# Altium project 测量放大器.PrjPCB
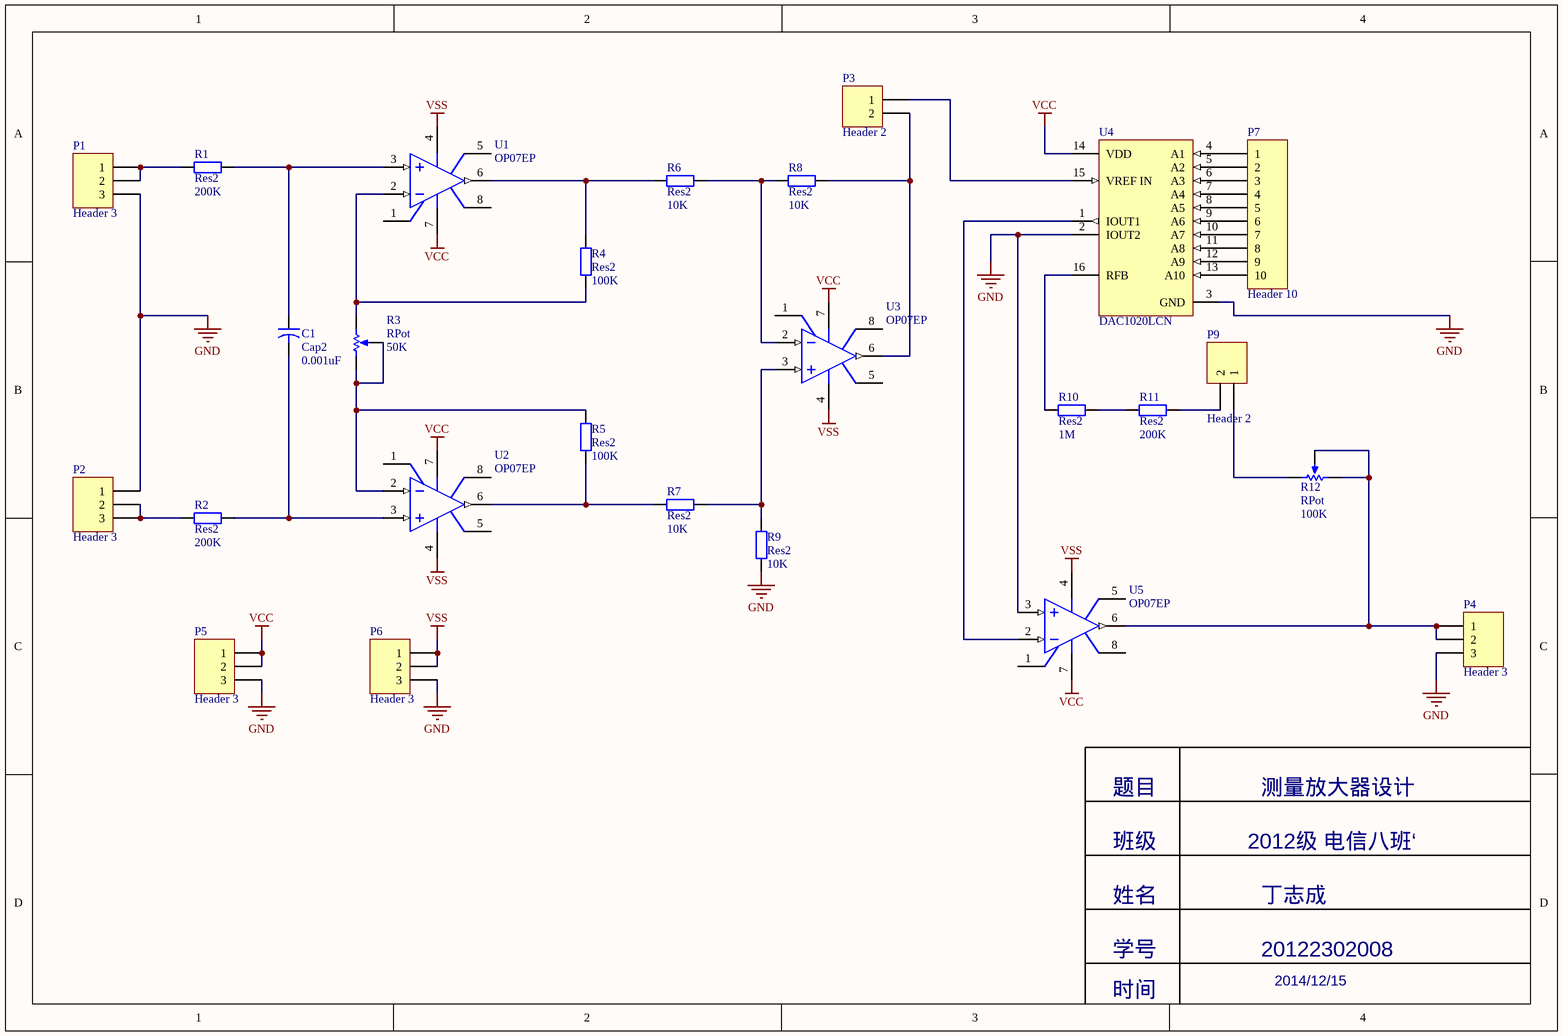
[diagram p0: 设计1.SchDoc]
1 sheet, 26 parts. Net scope: global (net labels, ports and power ports of the same name join across sheets).
Board files: 设计1-1.PCBDOC, 三人小组.PCBDOC, 三人小组v2.PCBDOC

## Sheet 设计1.SchDoc
size A4

### Parts
C1  Cap2  value 0.001uF  [CAPR5-4X5]
P1  Header 3  [HDR1X3]
P2  Header 3  [HDR1X3]
P3  Header 2  [HDR1X2]
P4  Header 3  [HDR1X3]
P5  Header 3  [HDR1X3]
P6  Header 3  [HDR1X3]
P7  Header 10  [HDR1X10]
P9  Header 2  [HDR1X2]
R1  Res2  value 200K  [AXIAL-0.4]
R2  Res2  value 200K  [AXIAL-0.4]
R3  RPot  value 50K  [VR5]
R4  Res2  value 100K  [AXIAL-0.4]
R5  Res2  value 100K  [AXIAL-0.4]
R6  Res2  value 10K  [AXIAL-0.4]
R7  Res2  value 10K  [AXIAL-0.4]
R8  Res2  value 10K  [AXIAL-0.4]
R9  Res2  value 10K  [AXIAL-0.4]
R10  Res2  value 1M  [AXIAL-0.4]
R11  Res2  value 200K  [AXIAL-0.4]
R12  RPot  value 100K  [VR5]
U1  OP07EP  [N-8_A]
U2  OP07EP  [N-8_A]
U3  OP07EP  [N-8_A]
U4  DAC1020LCN  [N16A]
U5  OP07EP  [N-8_A]

### Nets
GND: P1.3 P2.1 P4.3 P5.3 P6.3 R9.1 U4.2(IOUT2) U4.3(GND) U5.3(IN+)
VCC: P5.1 P5.2 U1.7(V+) U2.7(V+) U3.7(V+) U4.14(VDD) U5.7(V+)
VSS: P6.1 P6.2 U1.4(V-) U2.4(V-) U3.4(V-) U5.4(V-)
NetC1_1: C1.1 R1.2 U1.3(IN+)
NetC1_2: C1.2 R2.2 U2.3(IN+)
NetP1_1: P1.1 P1.2 R1.1
NetP2_2: P2.2 P2.3 R2.1
NetP3_1: P3.1 U4.15(VREF_IN)
NetP3_2: P3.2 R8.2 U3.6(OUT)
NetP4_1: P4.1 P4.2 R12.1(TOP) R12.3(TAP) U5.6(OUT)
NetP7_1: P7.1 U4.4(A1)
NetP7_2: P7.2 U4.5(A2)
NetP7_3: P7.3 U4.6(A3)
NetP7_4: P7.4 U4.7(A4)
NetP7_5: P7.5 U4.8(A5)
NetP7_6: P7.6 U4.9(A6)
NetP7_7: P7.7 U4.10(A7)
NetP7_8: P7.8 U4.11(A8)
NetP7_9: P7.9 U4.12(A9)
NetP7_10: P7.10 U4.13(A10)
NetP9_1: P9.1 R12.2(BOT)
NetP9_2: P9.2 R11.2
NetR3_1: R3.1(TOP) R3.3(TAP) R5.2 U2.2(IN-)
NetR3_2: R3.2(BOT) R4.1 U1.2(IN-)
NetR4_2: R4.2 R6.1 U1.6(OUT)
NetR5_1: R5.1 R7.1 U2.6(OUT)
NetR6_2: R6.2 R8.1 U3.2(IN-)
NetR7_2: R7.2 R9.2 U3.3(IN+)
NetR10_1: R10.1 U4.16(RFB)
NetR10_2: R10.2 R11.1
NetU4_1: U4.1(IOUT1) U5.2(IN-)

Not connected (* = marked no-connect by the designer): U1 1(VOSTRIM) 5(NC) 8(VOSTRIM); U2 1(VOSTRIM) 5(NC) 8(VOSTRIM); U3 1(VOSTRIM) 5(NC) 8(VOSTRIM); U5 1(VOSTRIM) 5(NC) 8(VOSTRIM)

### Notes on the sheet
- 题目
- 班级
- 2012级 电信八班‘
- 测量放大器设计
- 姓名
- 丁志成
- 学号
- 20122302008
- 2014/12/15
- 时间

### Library data of the parts
C1 = Cap2: Capacitor; Published: 23-Sep-2002; PackageReference: CAPR5-4X5; Publisher: Altium Limited
P1 P2 P4-P6 = Header 3: Header, 3-Pin; LatestRevisionDate: 17-Jul-2002; LatestRevisionNote: Re-released for DXP Platform.; Publisher: Altium Limited
P3 P9 = Header 2: Header, 2-Pin; LatestRevisionDate: 17-Jul-2002; LatestRevisionNote: Re-released for DXP Platform.; Publisher: Altium Limited
P7 = Header 10: Header, 10-Pin; LatestRevisionDate: 17-Jul-2002; LatestRevisionNote: Re-released for DXP Platform.; Publisher: Altium Limited
R1 R2 R4-R11 = Res2: Resistor; Published: 8-Jun-2000; LatestRevisionDate: 17-Jul-2002; LatestRevisionNote: Re-released for DXP Platform.; PackageReference: AXIAL-0.4; Publisher: Altium Limited
R3 R12 = RPot: Potentiometer; Sim Note: Enter the Resistance value and the set point into parameter fields.; Set Position: 0.5; Published: 8-Jun-2000; LatestRevisionDate: 17-Jul-2002; LatestRevisionNote: Re-released for DXP Platform.; PackageReference: VR5; Publisher: Altium Limited
U1-U3 U5 = OP07EP: Ultra-Low Offset Voltage Operational Amplifier; Note: Pin 5 is not connected.; Published: 8-Jun-2000; LatestRevisionDate: 04-Mar-2005; LatestRevisionNote: Stylized 3D Model Added.; DatasheetVersion: 1992; PackageReference: N-8_A; Publisher: Altium Limited; PackageDescription: DIP; 8 Leads; Row Spacing 7.62 mm; Pitch 2.54 mm; Code_JEDEC: MO-001-AN; ComponentLink1Description: Manufacturer Link; ComponentLink1URL: http://www.analog.com/en/prod/0,,759_786_OP07%2C00.html; ComponentLink2Description: Datasheet; ComponentLink2URL: http://www.analog.com/UploadedFiles/Data_Sheets/39161232478959OP07_c.pdf
U4 = DAC1020LCN: 10-Bit Binary Multiplying D/A Converter; ComponentAvailability: Obsolete; Published: 15-Apr-2002; LatestRevisionDate: 06-Jun-2005; LatestRevisionNote: Stylized 3D Model Added.; DatasheetVersion: May-1996; PackageVersion: 2000; PackageReference: N16A; Publisher: Altium Limited; PackageDescription: DIP; 16 Leads; Row Spacing 7.62 mm; Pitch 2.54 mm; ComponentLink1Description: Manufacturer Link; ComponentLink1URL: http://www.national.com/; ComponentLink2Description: Datasheet; ComponentLink2URL: http://www.national.com/ds.cgi/DA/DAC1020.pdf; ComponentLink3Description: Discontinuation Notice; ComponentLink3URL: http://www.national.com/obs/obsolescence.txt; ComponentLink4Description: URL Link1; ComponentLink4URL: http://www.national.com/pf/DA/DAC1020.html